# EAGLE design puiss-barillet (EAGLE 4.16)
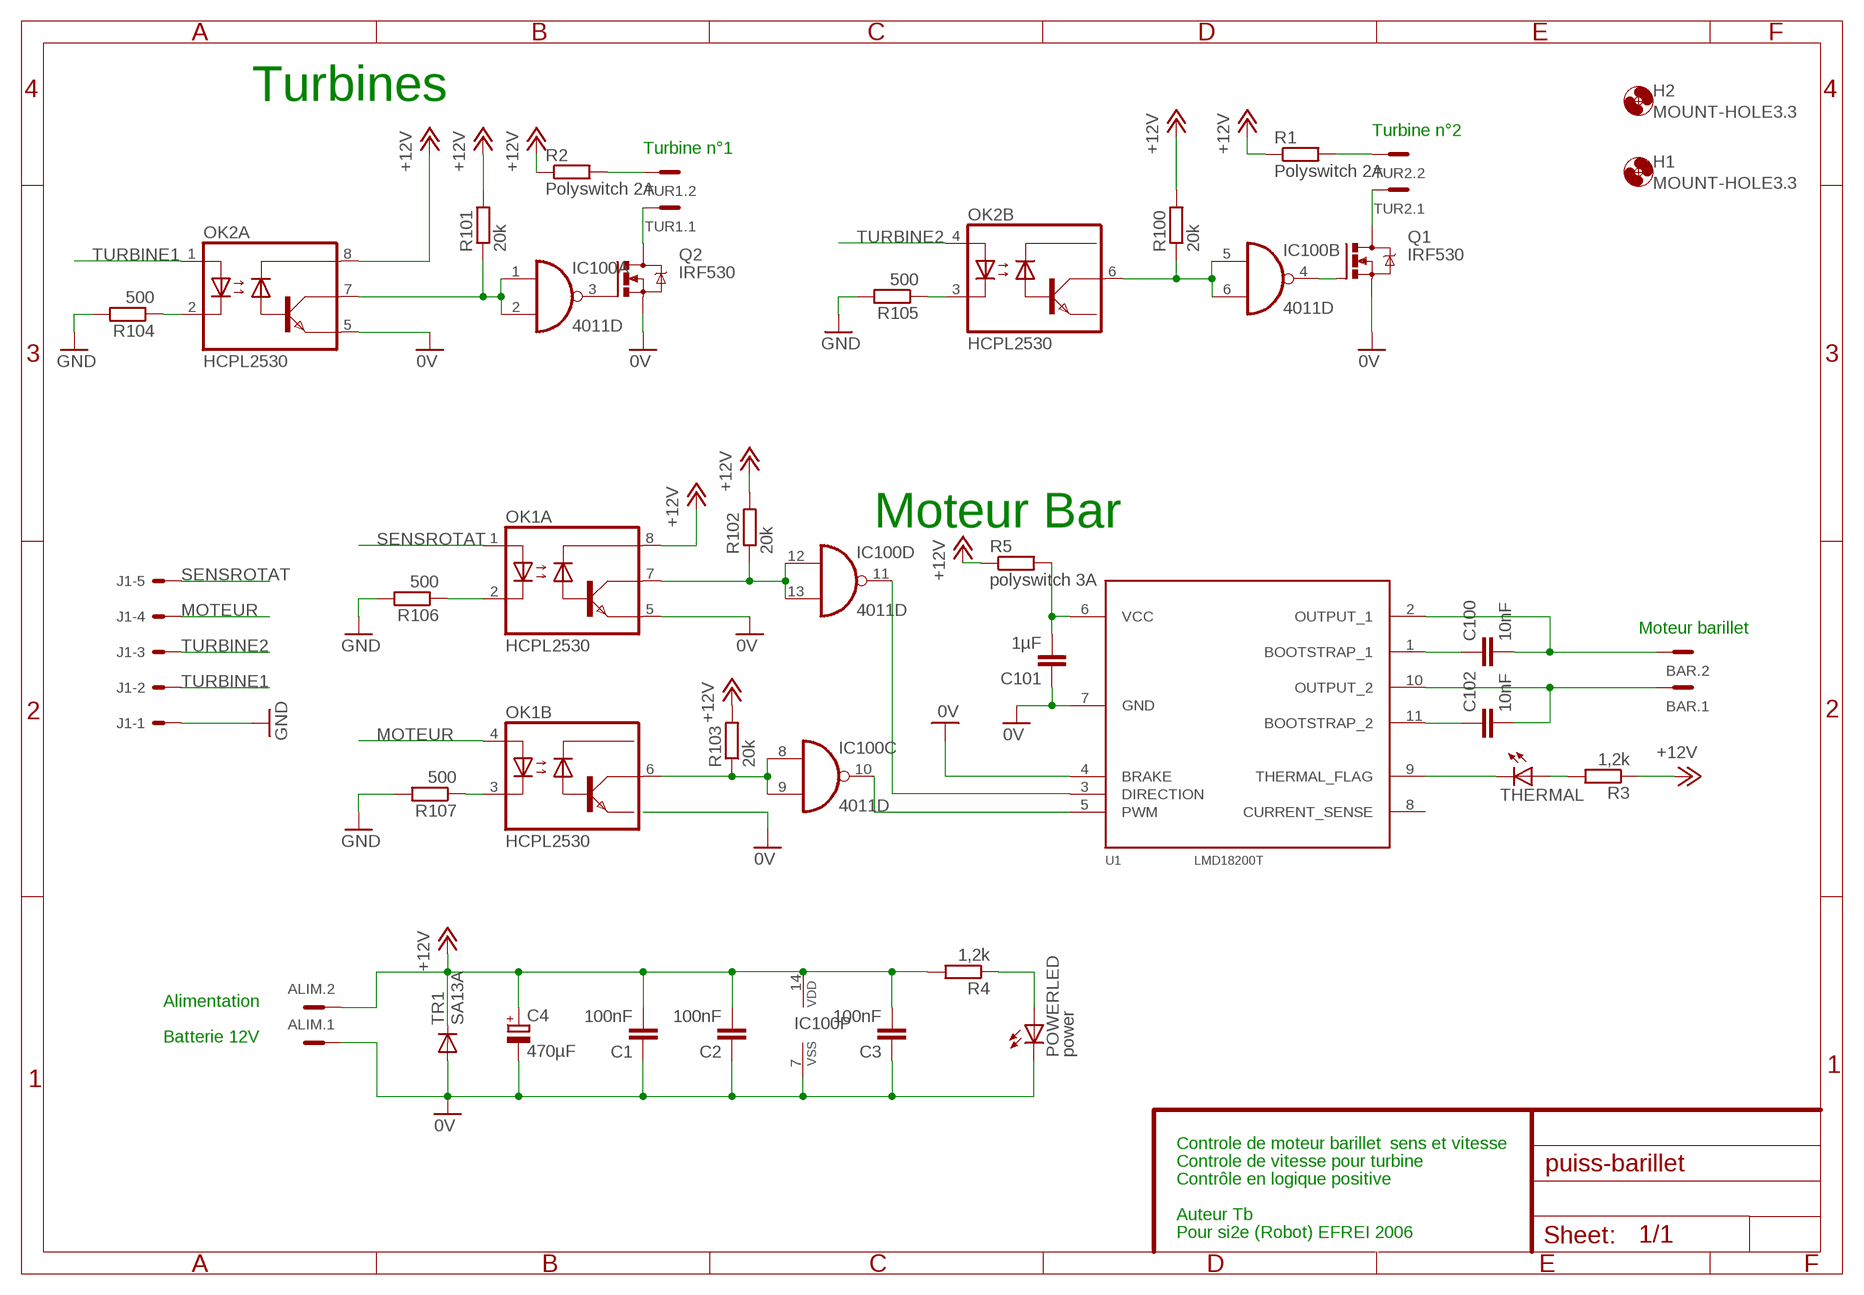
[diagram p0: schematic, sheet 1]

## Parts
ALIM  MC2  [MC2]
BAR  MC2  [MC2]
C1  100nF  C-EUC0603  [C0603]
C2  100nF  C-EUC0603  [C0603]
C3  100nF  C-EUC0603  [C0603]
C4  470µF  CPOL-EUG  [PANASONIC_G]
C100  10nF  C-EUC0603  [C0603]
C101  1µF  C-EUC0603  [C0603]
C102  10nF  C-EUC0603  [C0603]
H1  MOUNT-HOLE3.3  [3,3]
H2  MOUNT-HOLE3.3  [3,3]
IC100  4011D  [SO14]
J1  22-05-7058-05  [7395-05]
OK1  HCPL2530  [DIL08]
OK2  HCPL2530  [DIL08]
POWERLED  power  LEDSMT1206  [1206]
Q1  IRF530  [TO220BV]
Q2  IRF530  [TO220BV]
R1  Polyswitch 2A  R-EU_0207/15  [0207/15]
R2  Polyswitch 2A  R-EU_0207/15  [0207/15]
R3  1,2k  R-EU_R0603  [R0603]
R4  1,2k  R-EU_R0603  [R0603]
R5  polyswitch 3A  R-EU_0207/15  [0207/15]
R100  20k  R-EU_R0603  [R0603]
R101  20k  R-EU_R0603  [R0603]
R102  20k  R-EU_R0603  [R0603]
R103  20k  R-EU_R0603  [R0603]
R104  500  R-EU_R0603  [R0603]
R105  500  R-EU_R0603  [R0603]
R106  500  R-EU_R0603  [R0603]
R107  500  R-EU_R0603  [R0603]
THERMAL  LEDSMT1206  [1206]
TR1  SA13A  1N5400  [DO201-15]
TUR1  MC2  [MC2]
TUR2  MC2  [MC2]
U1  LMD18200T  [TO-220-11]

## Nets
0V [Alim]: ALIM.1 C1.1 C2.1 C3.1 C4.- C101.1 IC100.7(P:VSS) OK1.5(A:GND) OK2.5(A:GND) POWERLED.C Q1.S Q2.S TR1.A U1.4(BRAKE) U1.7(GND)
+12V [Alim]: ALIM.2 C1.2 C2.2 C3.2 C4.+ IC100.14(P:VDD) OK1.8(A:VCC) OK2.8(A:VCC) R1.1 R2.1 R3.1 R4.2 R5.1 R100.2 R101.2 R102.2 R103.2 TR1.C
GND: J1.1 R104.2 R105.2 R106.2 R107.2
MOTEUR: J1.4 OK1.4(B:A2)
N$1 [Alim]: BAR.2 C100.2 U1.2(OUTPUT_1)
N$2 [Alim]: BAR.1 C102.2 U1.10(OUTPUT_2)
N$3: IC100.1(A:I0) IC100.2(A:I1) OK2.7(A:VO1) R101.1
N$4: IC100.5(B:I0) IC100.6(B:I1) OK2.6(B:VO2) R100.1
N$5: IC100.11(D:O) U1.3(DIRECTION)
N$6: POWERLED.A R4.1
N$7 [Alim]: Q1.D TUR2.1
N$8 [Alim]: Q2.D TUR1.1
N$9: R3.2 THERMAL.A
N$10: IC100.3(A:O) Q2.G
N$11: OK1.2(A:C1) R106.1
N$12: OK1.3(B:C2) R107.1
N$13: IC100.10(C:O) U1.5(PWM)
N$14: THERMAL.C U1.9(THERMAL_FLAG)
N$15: C102.1 U1.11(BOOTSTRAP_2)
N$16: C100.1 U1.1(BOOTSTRAP_1)
N$17: OK2.2(A:C1) R104.1
N$18: OK2.3(B:C2) R105.1
N$19 [Alim]: C101.2 R5.2 U1.6(VCC)
N$20 [Alim]: R2.2 TUR1.2
N$21 [Alim]: R1.2 TUR2.2
N$22: IC100.4(B:O) Q1.G
N$23: IC100.12(D:I0) IC100.13(D:I1) OK1.7(A:VO1) R102.1
N$24: IC100.8(C:I0) IC100.9(C:I1) OK1.6(B:VO2) R103.1
SENSROTAT: J1.5 OK1.1(A:A1)
TURBINE1: J1.2 OK2.1(A:A1)
TURBINE2: J1.3 OK2.4(B:A2)
Unconnected: U1.8(CURRENT_SENSE)

## Notes on the sheet
- Turbines
- Turbine n°2
- Turbine n°1
- Moteur Bar
- Moteur barillet
- Alimentation
- Batterie 12V
- Controle de moteur barillet | sens et vitesse
- Controle de vitesse pour turbine
- Contrôle en logique positive
- Auteur Tb
- Pour si2e (Robot) EFREI 2006

## Library data of the parts
ALIM BAR TUR1 TUR2 = con-phoenix-381_l:MC2: Mini-Combicon 3.81mm horizontal 2-polig MC 1,5/2-G-3,81 Artikel-Nr. 1803277
C1-C3 C100-C102 = rcl:C-EU: CAPACITOR, European symbol
C4 = rcl:CPOL-EU: POLARIZED CAPACITOR, European symbol
H1 H2 = holes:MOUNT-HOLE: MOUNTING HOLE with drill center marker
IC100 = 40xx:4011: Quad 2-input NAND
J1 = ep_molex_6410_7395-02:22-?-05: CONNECTOR wire to board 2.54 mm (.1 inch) pitch header
OK1 OK2 = optocoupler:HCPL2530: HEWLETT PACKARD OPTO COUPLER
POWERLED THERMAL = led:LED: LED OSRAM: - CHIPLED LG R971, LG N971, LY N971, LG Q971, LY Q971, LO R971, LY R971 LH N974, LH R974 LS Q976, LO Q976, LY Q976 LO Q996 - Hyper CHIPLED LW Q18S LB Q993, LB Q99A, LB R99A - SideLED LS A670, LO A670, LY A670, LG A670, LP A670 LB A673, LV A673, LT A673, LW A673 LH A674 LY A675 LS A676, LA A676, LO A676, LY A676, LW A676 LS A679, LY A679, LG A679 - Hyper Micro SIDELED® LS Y876, LA Y876, LO Y876, LY Y876 LT Y87S - SmartLED LW L88C, LW L88S LB L89C, LB L89S, LG L890 LS L89K, LO L89K, LY L89K LS L896, LA L896, LO L896, LY L896 - TOPLED LS T670, LO T670, LY T670, LG T670, LP T670 LSG T670, LSP T670, LSY T670, LOP T670, LYG T670 LG T671, LOG T671, LSG T671 LB T673, LV T673, LT T673, LW T673 LH T674 LS T676, LA T676, LO T676, LY T676, LB T676, LH T676, LSB T676, LW T676 LB T67C, LV T67C, LT T67C, LS T67K, LO T67K, LY T67K, LW E67C LS E67B, LA E67B, LO E67B, LY E67B, LB E67C, LV E67C, LT E67C LW T67C LS T679, LY T679, LG T679 LS T770, LO T770, LY T770, LG T770, LP T770 LB T773, LV T773, LT T773, LW T773 LH T774 LS E675, LA E675, LY E675, LS T675 LS T776, LA T776, LO T776, LY T776, LB T776 LHGB T686 LT T68C, LB T68C - Hyper Mini TOPLED® LB M676 - Mini TOPLED Santana® LG M470 LS M47K, LO M47K, LY M47K Source: http://www.osram.convergy.de/
Q1 Q2 = transistor-power:IRF530: HEXFET Power MOSFET
R1-R5 R100-R107 = rcl:R-EU_: RESISTOR, European symbol
TR1 = diode:1N5400: DIODE standard rectifier, 3 A, 50 V (Motorola)
U1 = lmd1820x:LMD18200: National Semiconductor LMD18200 3A, 55V H-Bridge

## Net classes
0 default: width 0.508 mm, clearance 0.7 mm
1 Alim: width 1.27 mm, drill 0.508 mm, clearance 1.1 mm

## Board
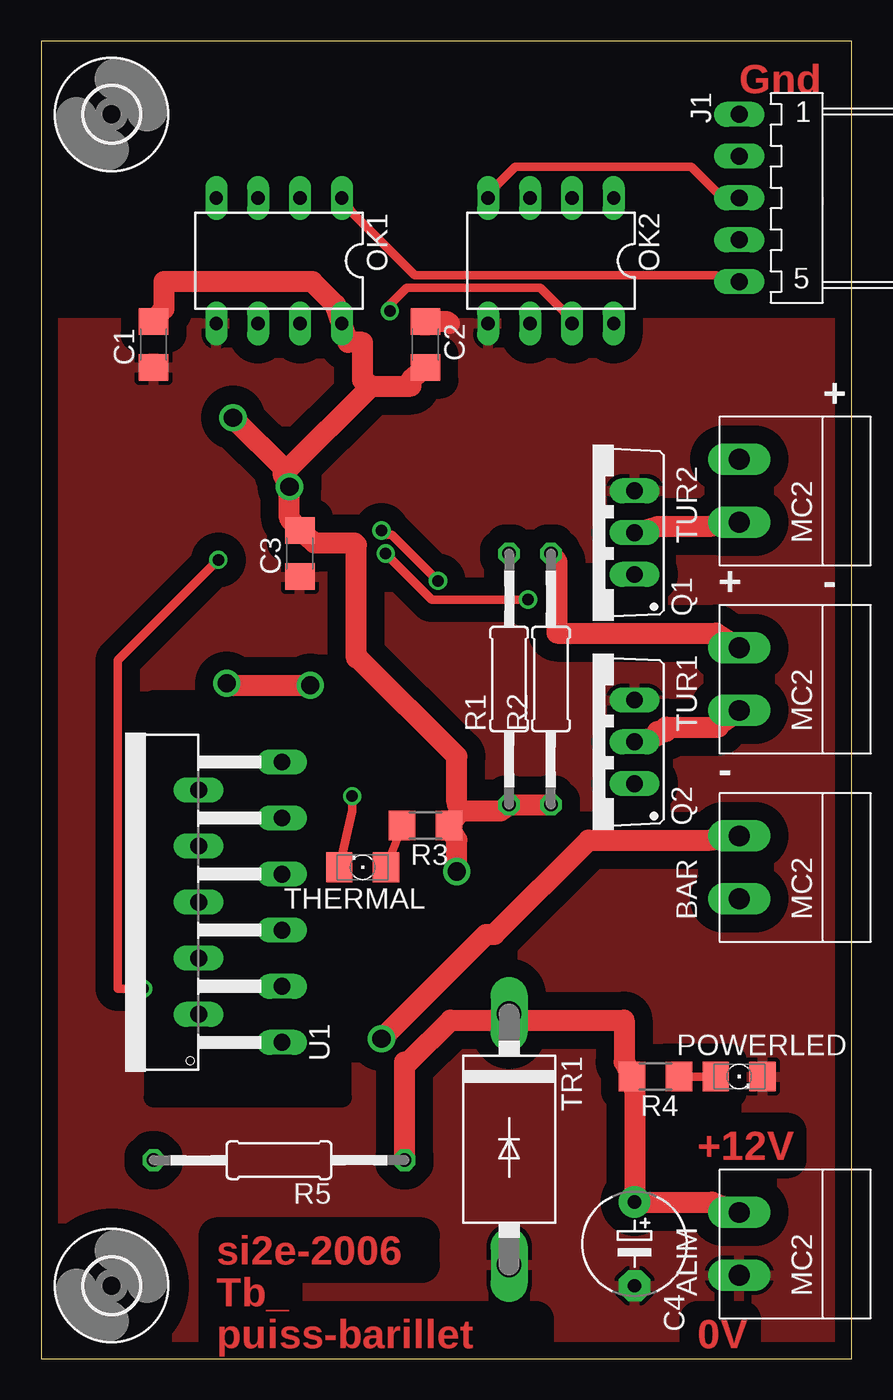
[diagram p1: board, top side]
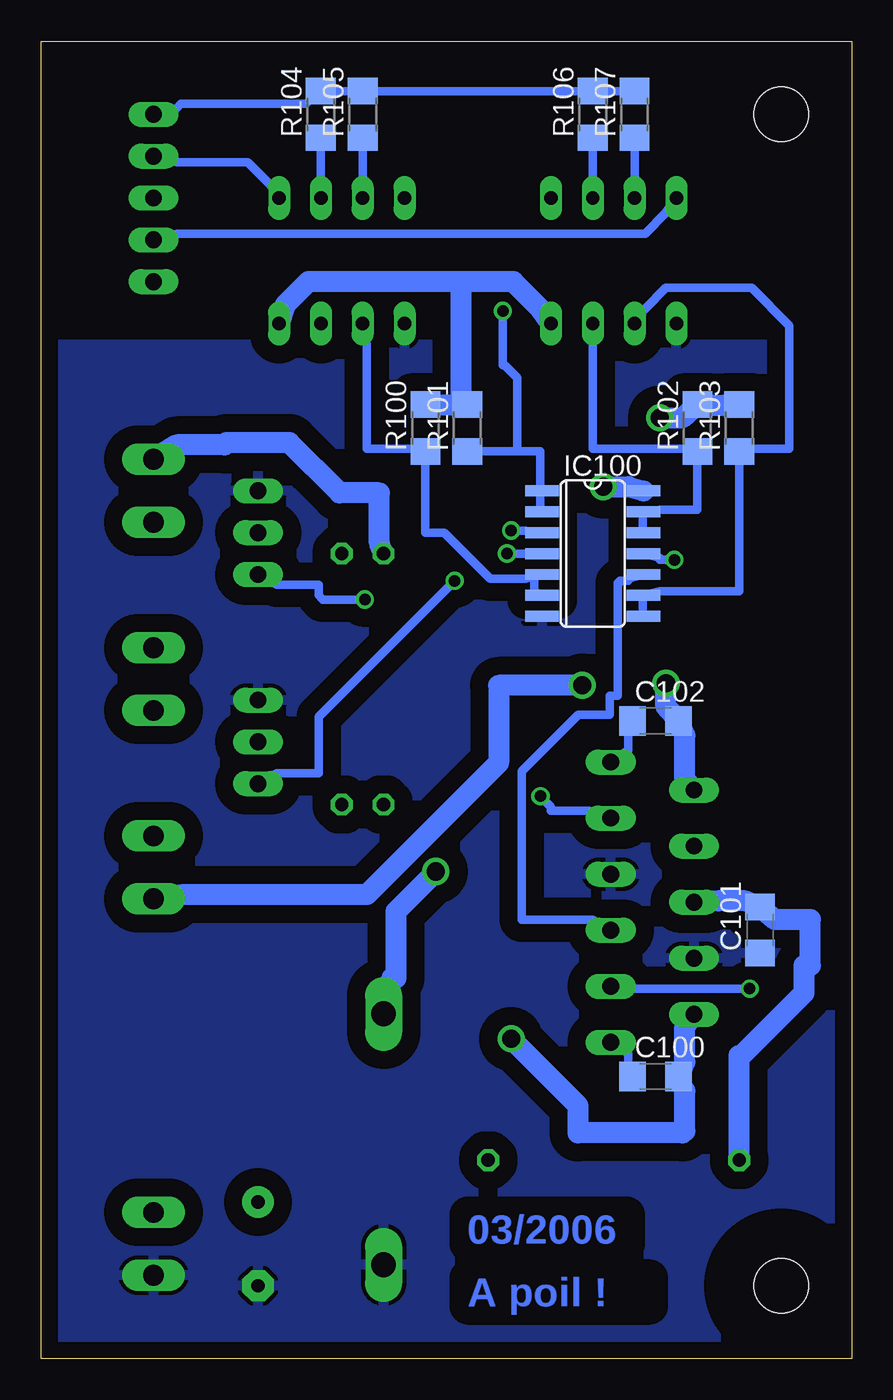
[diagram p2: board, bottom side, seen from below]

Size 49.2 x 80 mm. Coordinates in mm from the lower left corner, seen from the top.
Outline: 0,0 49.2,0 49.2,80 0,80 0,0
Copper layers (1*16): Top 0.035mm / dielectric 1.5mm / Bottom 0.035mm
Design rules "olimex": minimum track width 10mil, minimum drill 24mil, track to track 10mil, track to pad 10mil, pad to pad 10mil, via to via 10mil, smd to smd 10mil, copper to edge 40mil, drill to drill 10mil, minimum pad ring 10mil, minimum via ring 8mil, stop-mask expansion 0mil, vias tented up to drill 0mil, thermal gap 10mil
tRestrict: area 6.8,15.9 to 18.2,40

### Footprints (pad centres in the part's own frame; a part is rotated, then mirrored left to right if it is on the bottom)
MC2 = drill 1.27 long: 1 -1.905,0; 2 1.905,0
C1206 = smd 1.6 x 1.8: 1 -1.4,0; 2 1.4,0
E5-6 = drill 0.813 pad 1.905 round: + -2.54,0 | drill 0.813 pad 1.905 octagon: - 2.54,0
3,3 = hole 3.3: 0,0
SO14 = smd 0.66 x 2.032: 1 -3.81,-3.073; 2 -2.54,-3.073; 3 -1.27,-3.073; 4 0,-3.073; 5 1.27,-3.073; 6 2.54,-3.073; 7 3.81,-3.073; 8 3.81,3.073; 9 2.54,3.073; 10 1.27,3.073; 11 0,3.073; 12 -1.27,3.073; 13 -2.54,3.073; 14 -3.81,3.073
7395-05 = drill 1.016 long: 1 5.08,0; 2 2.54,0; 3 0,0; 4 -2.54,0; 5 -5.08,0
DIL08 = drill 0.813 long: 1 -3.81,-3.81; 2 -1.27,-3.81; 3 1.27,-3.81; 4 3.81,-3.81; 5 3.81,3.81; 6 1.27,3.81; 7 -1.27,3.81; 8 -3.81,3.81
1206 = smd 1.6 x 1.803: A -1.422,0; C 1.422,0
TO220BV = drill 1.016 long: D 0,-2.54; G -2.54,-2.54; S 2.54,-2.54
0207/15 = drill 0.813 octagon: 1 -7.62,0; 2 7.62,0
R1206 = smd 1.6 x 1.803: 1 -1.422,0; 2 1.422,0
DO201-15 = drill 1.499 long: A 7.62,0; C -7.62,0
TO-220-11 = drill 1.016 long: 1 -8.084,-2.718; 2 -6.382,2.337; 3 -4.68,-2.718; 4 -2.978,2.337; 5 -1.276,-2.718; 6 0.425,2.337; 7 2.127,-2.718; 8 3.829,2.337; 9 5.531,-2.718; 10 7.233,2.337; 11 8.934,-2.718

### Placement (x,y rotation side)
ALIM  42.38,6.98 90 top
BAR  42.38,29.84 90 top
C1  100nF  [C1206]  6.82,61.59 90 top
C2  100nF  [C1206]  23.33,61.59 270 top
C3  100nF  [C1206]  15.71,48.89 90 top
C4  470µF  [E5-6]  36.03,6.98 270 top
C100  10nF  [C1206]  11.9,17.14 0 bottom
C101  1µF  [C1206]  5.55,26.03 90 bottom
C102  10nF  [C1206]  11.9,38.73 0 bottom
H1  4.28,75.56 0 top
H2  4.28,4.44 0 top
IC100  15.71,48.89 270 bottom
J1  42.38,70.48 90 top
OK1  14.44,66.67 180 top
OK2  30.95,66.67 180 top
POWERLED  42.38,17.14 0 top
Q1  33.49,50.16 90 top
Q2  33.49,37.46 90 top
R1  28.41,41.27 90 top
R2  30.95,41.27 90 top
R3  1,2k  [R1206]  23.33,32.38 180 top
R4  1,2k  [R1206]  37.3,17.14 180 top
R5  14.44,12.06 180 top
R100  20k  [R1206]  25.87,56.51 90 bottom
R101  20k  [R1206]  23.33,56.51 90 bottom
R102  20k  [R1206]  9.36,56.51 90 bottom
R103  20k  [R1206]  6.82,56.51 90 bottom
R104  500  [R1206]  32.22,75.56 90 bottom
R105  500  [R1206]  29.68,75.56 90 bottom
R106  500  [R1206]  15.71,75.56 90 bottom
R107  500  [R1206]  13.17,75.56 90 bottom
THERMAL  19.52,29.84 180 top
TR1  28.41,13.33 270 top
TUR1  42.38,41.27 90 top
TUR2  42.38,52.7 90 top
U1  11.9,27.3 90 top

### Tracks (layer width: path | path; a pad name or v marks a point on that pad's centre or on a via)
0V
  Top 1.27: C2.1 24.22,62.99 24.6,62.99 24.79,62.86
  pour Bottom (isolate 0.61): 48.73,61.59 0.47,61.59 0.47,0.63 48.73,0.63
  pour Top (isolate 0.61): 48.73,62.86 0.47,62.86 0.47,0.63 48.73,0.63
+12V  (via drill 1.1)
  Top 1.27: 20.03,59.05 22.44,59.05 22.44,59.43 C2.2 | 14.88,53.91 14.69,53.72 v15.08,52.95 15.08,51.05 C3.2 16.6,49.53 19.01,49.53 19.14,49.4 19.14,42.54 19.27,42.54 25.23,36.57 25.23,33.78 25.49,33.27 | 14.88,53.91 20.03,59.05 | 14.88,53.91 v11.65,57.15 | C1.2 7.46,63.75 7.46,65.4 16.47,65.4 17.87,64 OK1.8 18.63,61.72 19.52,61.72 19.52,59.43 20.03,59.05 | ALIM.2 40.73,9.52 C4.+ 36.03,16.25 R4.2 35.39,18.03 35.39,20.57 29.43,20.57 TR1.C 27.39,20.57 24.85,20.57 22.31,18.03 22.06,18.03 R5.1 | 25.49,33.27 27.9,33.27 R1.1 R2.1 | 25.49,33.27 R3.1 25.23,31.49 v25.23,29.59
  Bottom 1.27: R103.2 7.71,57.91 8.47,57.91 R102.2 10.25,57.15 v11.65,57.15 | v15.08,52.95 13.55,52.95 IC100.14 | R100.2 24.98,57.91 24.22,57.91 R101.2 23.71,58.67 23.71,65.4 | 23.71,65.4 20.54,65.4 18.88,63.75 OK1.8 | 23.71,65.4 32.98,65.4 34.38,64 OK2.8 | v25.23,29.59 27.65,27.17 27.65,23.11 27.9,23.11 TR1.C
GND
  Bottom 0.508: R107.2 14.06,76.96 14.82,76.96 R106.2 16.6,76.96 28.79,76.96 R105.2 30.57,76.96 31.33,76.96 R104.2 33.11,76.19 40.73,76.19 40.98,75.94 J1.1
MOTEUR
  Bottom 0.508: OK1.4 11.27,69.59 12.54,68.32 40.98,68.32 J1.4
N$1  (via drill 1.1)
  Top 1.27: v20.66,19.43 27.01,25.78 27.52,25.78 33.24,31.49 40.6,31.49 BAR.2
  Bottom 1.27: U1.2 10.12,20.19 10.12,18.03 C100.2 10.12,16.25 10.12,13.84 10.25,13.71 16.6,13.71 16.6,15.36 v20.66,19.43
N$2  (via drill 1.1)
  Top 1.27: v16.34,40.89 11.27,40.89 v11.27,41.02
  Bottom 1.27: U1.10 10.12,35.17 10.12,37.84 C102.2 11.27,39.62 v11.27,41.02 | v16.34,40.89 21.42,40.89 21.42,36.19 29.43,28.19 40.6,28.19 BAR.1
N$3  (via drill 0.7)
  Top 0.508: v21.17,63.62 21.17,64 22.19,65.02 30.31,65.02 31.58,63.75 OK2.7
  Bottom 0.508: 20.28,55.11 18.88,55.11 18.88,52.95 IC100.1 18.88,52.45 18.88,51.68 IC100.2 | 20.28,55.11 22.44,55.11 R101.1 | v21.17,63.62 21.17,60.32 21.04,60.32 20.28,59.56 20.28,55.11
N$4
  Bottom 0.508: 19.33,47.48 19.77,47.37 21.93,47.37 24.73,50.16 25.87,50.16 R100.1 26.76,55.24 29.43,55.24 29.43,61.59 OK2.6 | 19.33,47.48 IC100.5 | IC100.6 19.27,46.6 19.27,47.24 19.33,47.48
N$5  (via drill 0.7)
  Top 0.508: v10.76,48.51 4.66,42.41 4.66,22.47 v6.18,22.47
  Bottom 0.508: v10.76,48.51 11.65,48.51 11.65,48.64 IC100.11 | v6.18,22.47 13.17,22.47 U1.3
N$6
  Top 0.508: POWERLED.A R4.1
N$7
  Top 1.27: Q1.D 37.43,50.54 40.6,50.54 TUR2.1
N$8
  Top 1.27: Q2.D 37.43,37.84 37.43,38.1 37.94,38.1 37.94,38.35 41.11,38.35 41.11,38.48 TUR1.1
N$9
  Top 0.508: THERMAL.A R3.2
N$10  (via drill 0.7)
  Top 0.508: v20.66,50.29 20.92,50.03 21.3,50.03 v24.09,47.24
  Bottom 0.508: v20.66,50.29 19.77,50.29 IC100.3 | v24.09,47.24 32.35,38.98 32.35,35.55 34.89,35.55 Q2.G
N$11
  Bottom 0.508: OK1.2 R106.1
N$12
  Bottom 0.508: OK1.3 R107.1
N$13
  Bottom 0.508: IC100.10 13.55,47.37 13.55,47.24 14.06,47.24 14.06,47.11 14.19,47.11 14.19,40.25 14.69,40.25 14.69,39.11 16.6,39.11 20.03,35.68 20.03,26.66 15.71,26.66 U1.5
N$14  (via drill 0.7)
  Top 0.508: v18.88,34.16 18.88,33.27 THERMAL.C
  Bottom 0.508: v18.88,34.16 18.25,33.52 18.25,33.27 15.96,33.27 U1.9
N$15
  Bottom 0.508: C102.1 13.55,37.84 13.55,36.95 U1.11
N$16
  Bottom 0.508: C100.1 13.55,18.03 13.55,18.54 U1.1
N$17
  Bottom 0.508: OK2.2 R104.1
N$18
  Bottom 0.508: OK2.3 R105.1
N$19
  Bottom 1.27: U1.6 8.09,27.81 6.44,27.81 C101.2 4.66,26.66 2.5,26.66 2.5,23.87 2.88,23.87 2.88,22.22 6.69,18.41 6.82,18.41 R5.2
N$20
  Top 1.27: R2.2 31.33,48.38 31.33,44.06 40.98,44.06 TUR1.2
N$21
  Bottom 1.27: R1.2 28.66,49.53 28.66,52.57 31.08,52.57 34.12,55.62 37.94,55.62 38.06,55.49 40.98,55.49 TUR2.2
N$22  (via drill 0.7)
  Top 0.508: v20.92,48.89 23.71,46.1 v29.55,46.1
  Bottom 0.508: v29.55,46.1 32.09,46.1 32.35,46.35 32.35,46.98 34.89,46.98 Q1.G | IC100.4 v20.92,48.89
N$23
  Bottom 0.508: IC100.12 12.66,50.41 12.66,51.18 IC100.13 11.65,51.56 9.36,51.56 R102.1 10.25,55.24 15.71,55.24 OK1.7
N$24
  Bottom 0.508: IC100.8 12.66,45.33 12.66,46.1 IC100.9 11.65,46.6 6.82,46.6 R103.1 5.93,55.24 3.77,55.24 3.77,62.73 6.06,65.02 11.27,65.02 12.54,63.75 OK1.6
SENSROTAT
  Top 0.508: OK1.1 18.88,69.59 22.7,65.78 40.98,65.78 J1.5
TURBINE1
  Bottom 0.508: OK2.1 35.39,71.37 36.66,72.64 40.98,72.64 J1.2
TURBINE2
  Top 0.508: OK2.4 27.77,71.37 28.79,72.38 39.46,72.38 40.98,70.86 J1.3

### Text on the board
Top: Gnd | +12V | si2e-2006 | Tb_ | puiss-barillet | 0V
Bottom: 03/2006 | A poil !
tPlace: + | + | - | -